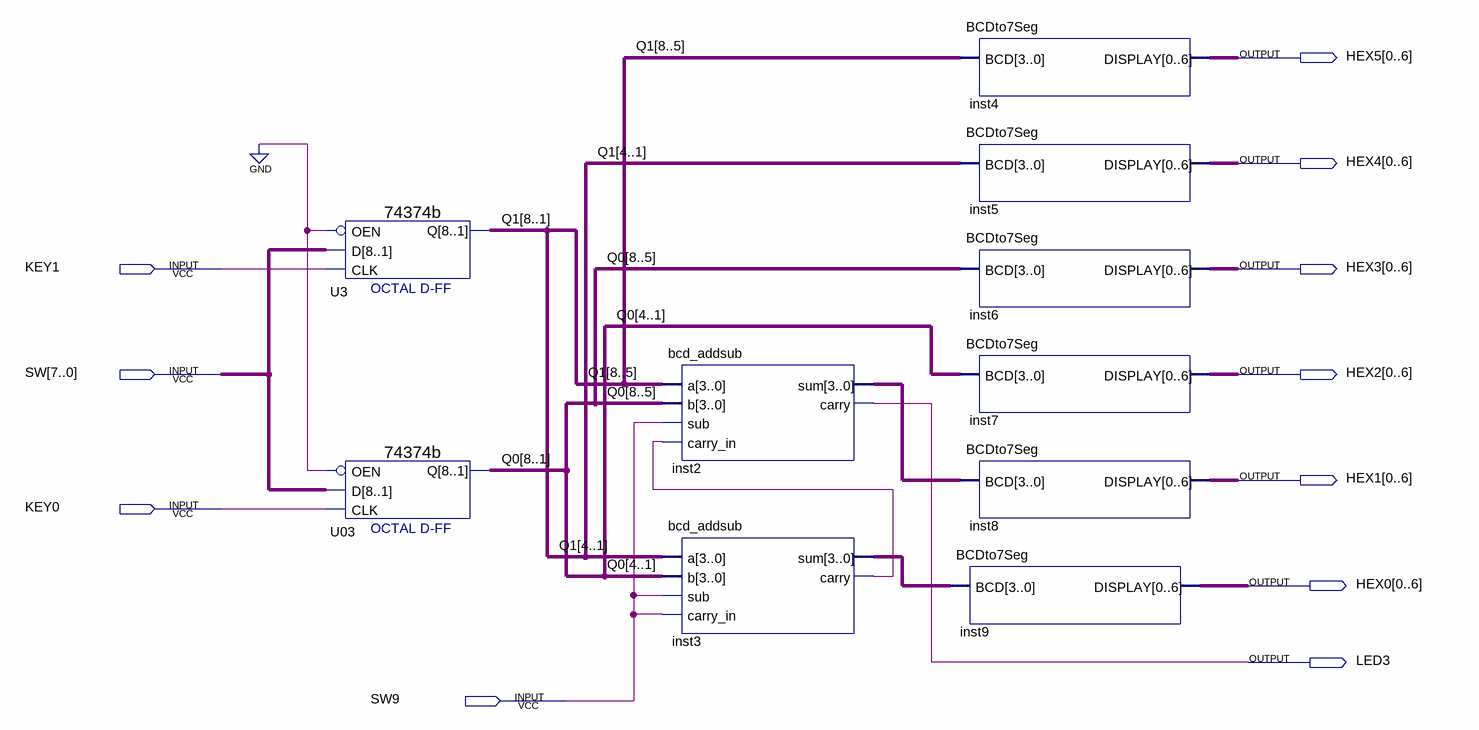
[diagram p0: schematic sheet]
// Quartus schematic bcd2.bdf as structural Verilog: 10 symbols, 11 pins
module bcd2 (
  input  KEY1,
  input  [7:0] SW,
  input  KEY0,
  input  SW9,
  output [0:6] HEX5,
  output [0:6] HEX4,
  output [0:6] HEX3,
  output [0:6] HEX2,
  output [0:6] HEX1,
  output [0:6] HEX0,
  output LED3
);

  wire inst3_carry;
  wire [3:0] inst2_sum, inst3_sum;
  wire [8:1] Q0, Q1;

  \74374b  U3 (.D(SW), .OEN(1'b0), .CLK(KEY1), .Q(Q1));
  \74374b  U03 (.D(SW), .OEN(1'b0), .CLK(KEY0), .Q(Q0));
  bcd_addsub inst2 (.a(Q1[8:5]), .b(Q0[8:5]), .sub(SW9), .carry_in(inst3_carry), .sum(inst2_sum), .carry(LED3));
  bcd_addsub inst3 (.a(Q1[4:1]), .b(Q0[4:1]), .sub(SW9), .carry_in(SW9), .sum(inst3_sum), .carry(inst3_carry));
  BCDto7Seg inst4 (.BCD(Q1[8:5]), .DISPLAY(HEX5));
  BCDto7Seg inst5 (.BCD(Q1[4:1]), .DISPLAY(HEX4));
  BCDto7Seg inst6 (.BCD(Q0[8:5]), .DISPLAY(HEX3));
  BCDto7Seg inst7 (.BCD(Q0[4:1]), .DISPLAY(HEX2));
  BCDto7Seg inst8 (.BCD(inst2_sum), .DISPLAY(HEX1));
  BCDto7Seg inst9 (.BCD(inst3_sum), .DISPLAY(HEX0));
endmodule
